# Altium schematic sheet Part13_Power.SchDoc
size A4
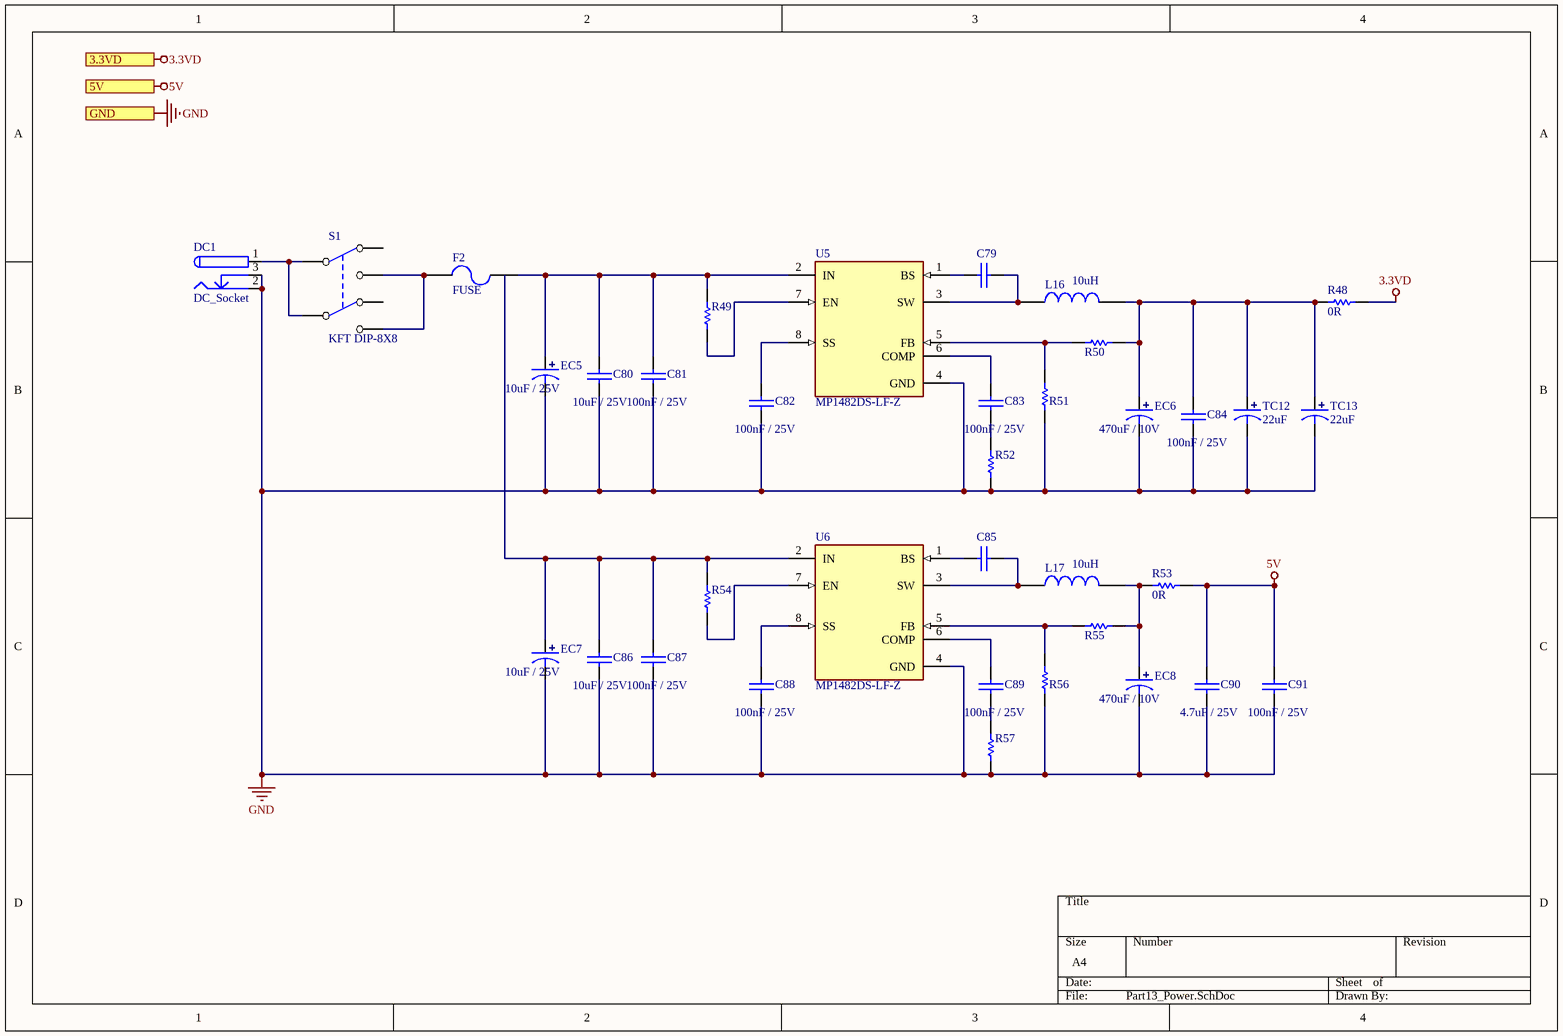
[diagram p0: Part13_Power.SchDoc]

## Parts
C79  10nF / 25V  [0603C]  (value not drawn)
C80  10uF / 25V  [0603C]
C81  100nF / 25V  [0603C]
C82  100nF / 25V  [0603C]
C83  100nF / 25V  [0603C]
C84  100nF / 25V  [0603C]
C85  10nF / 25V  [0603C]  (value not drawn)
C86  10uF / 25V  [0603C]
C87  100nF / 25V  [0603C]
C88  100nF / 25V  [0603C]
C89  100nF / 25V  [0603C]
C90  4.7uF / 25V  [0603C]
C91  100nF / 25V  [0603C]
DC1  DC_Socket  [DC-005]
EC5  10uF / 25V  [SMD-EC4.0X4.3X5.4]
EC6  470uF / 10V  [SMD-EC6.3X6.3X10]
EC7  10uF / 25V  [SMD-EC4.0X4.3X5.4]
EC8  470uF / 10V  [SMD-EC6.3X6.3X10]
F2  FUSE  [FUSE-1210]
L16  10uH  [CD42]
L17  10uH  [CD42]
R48  0R  [0603R]
R49  30K  [0402R]  (value not drawn)
R50  26.1k / 1%  [0402R]  (value not drawn)
R51  10K / 1%  [0402R]  (value not drawn)
R52  5.6k  [0402R]  (value not drawn)
R53  0R  [0603R]
R54  30K  [0402R]  (value not drawn)
R55  26.1k / 1%  [0402R]  (value not drawn)
R56  10K / 1%  [0402R]  (value not drawn)
R57  5.6k  [0402R]  (value not drawn)
S1  KFT DIP-8X8  [KFT DIP-8X8]
TC12  22uF  [TAJ-A/3216]
TC13  22uF  [TAJ-A/3216]
U5  MP1482DS-LF-Z  [FP-MP1482DS-LF-Z-MFG]
U6  MP1482DS-LF-Z  [FP-MP1482DS-LF-Z-MFG]

## Ports
3.3VD, 5V, GND

## Nets
3.3VD: R48.2 ; port 3.3VD
5V: C90.2 C91.2 R53.2 ; port 5V
GND: C80.1 C81.1 C82.1 C84.1 C86.1 C87.1 C88.1 C90.1 C91.1 DC1.2 DC1.3 EC5.2 EC6.2 EC7.2 EC8.2 R51.1 R52.2 R56.1 R57.2 TC12.2 TC13.2 U5.4(GND) U6.4(GND) ; port GND
NetC79_1: C79.1 L16.1 U5.3(SW)
NetC79_2: C79.2 U5.1(BS)
NetC80_2: C80.2 C81.2 EC5.1 F2.2 R49.1 U5.2(IN)
NetC82_2: C82.2 U5.8(SS)
NetC83_1: C83.1 R52.1
NetC83_2: C83.2 U5.6(COMP)
NetC84_2: C84.2 EC6.1 L16.2 R48.1 R50.2 TC12.1 TC13.1
NetC85_1: C85.1 L17.1 U6.3(SW)
NetC85_2: C85.2 U6.1(BS)
NetC86_2: C86.2 C87.2 EC7.1 R54.1 U6.2(IN)
NetC88_2: C88.2 U6.8(SS)
NetC89_1: C89.1 R57.1
NetC89_2: C89.2 U6.6(COMP)
NetDC1_1: DC1.1 S1.2 S1.5
NetEC8_1: EC8.1 L17.2 R53.1 R55.2
NetF2_1: F2.1 S1.1 S1.6
NetR49_2: R49.2 U5.7(EN)
NetR50_1: R50.1 R51.2 U5.5(FB)
NetR54_2: R54.2 U6.7(EN)
NetR55_1: R55.1 R56.2 U6.5(FB)

Not connected (* = marked no-connect by the designer): S1 3 4

## Library data of the parts
C79-C91 = CAP: 无极性电容
EC5-EC8 = SMD_ECAP: 贴片电解电容
L16 L17 = INDUCTOR
R48-R57 = RES
TC12 TC13 = TCAP: 钽电容
U5 U6 = CMP-57379-000001-1: IC REG BUCK ADJUSTABLE 2A 8SOIC; Manufacturer: Monolithic Power Systems; Max Duty Cycle: 90%; Switching Frequency: 340kHz; Standoff Height: 0.1mm; Max Power Dissipation: 1.38W; Output Type: AdjustableProgrammable; Output Voltage: 0.923-15V; Nominal Supply Current: 1.3mA; Max Supply Voltage: 18V; Max Junction Temp: +125°C; Number Of Outputs: 1; Min Supply Voltage: 4.75V; Switching Topology: Buck; Ambient Temperature Range High: +85°C; Temperature: -40°C to +125°C; Device Class L2: Power Management ICs; Mouser Description: MP1482 Series 18 V 2 A SMT Synchronous Rectified Step-Down Converter-SOIC-8; Device Class L3: Voltage Regulators - Switching; Ipc Land Pattern Name: SOIC127P600X155-8; Automotive: No; Octopart: https://octopart.com/mp1482ds-lf-z-monolithic+power+systems-17392490; ComponentLink2Description: Datasheet; RoHS: TRUE; Height: 1.75mm; Digikey Description: IC REG BUCK ADJUSTABLE 2A 8SOIC; Lead Free: Yes; Device Class L1: Integrated Circuits (ICs); Temperature Range Low: -40°C; Category: IC; Manufacturer Part Number: MP1482DS-LF-Z; Package: 0; Output Current: 2A; ComponentLink2URL: https://www.monolithicpower.com/en/documentview/productdocument/index/version/2/document_type/Datasheet/lang/en/sku/MP1482/document_id/344/; Temperature Range High: +125°C; Ambient Temperature Range Low: -40°C